# Altium schematic sheet Schematic_Alarm_tone.SchDoc
size Letter
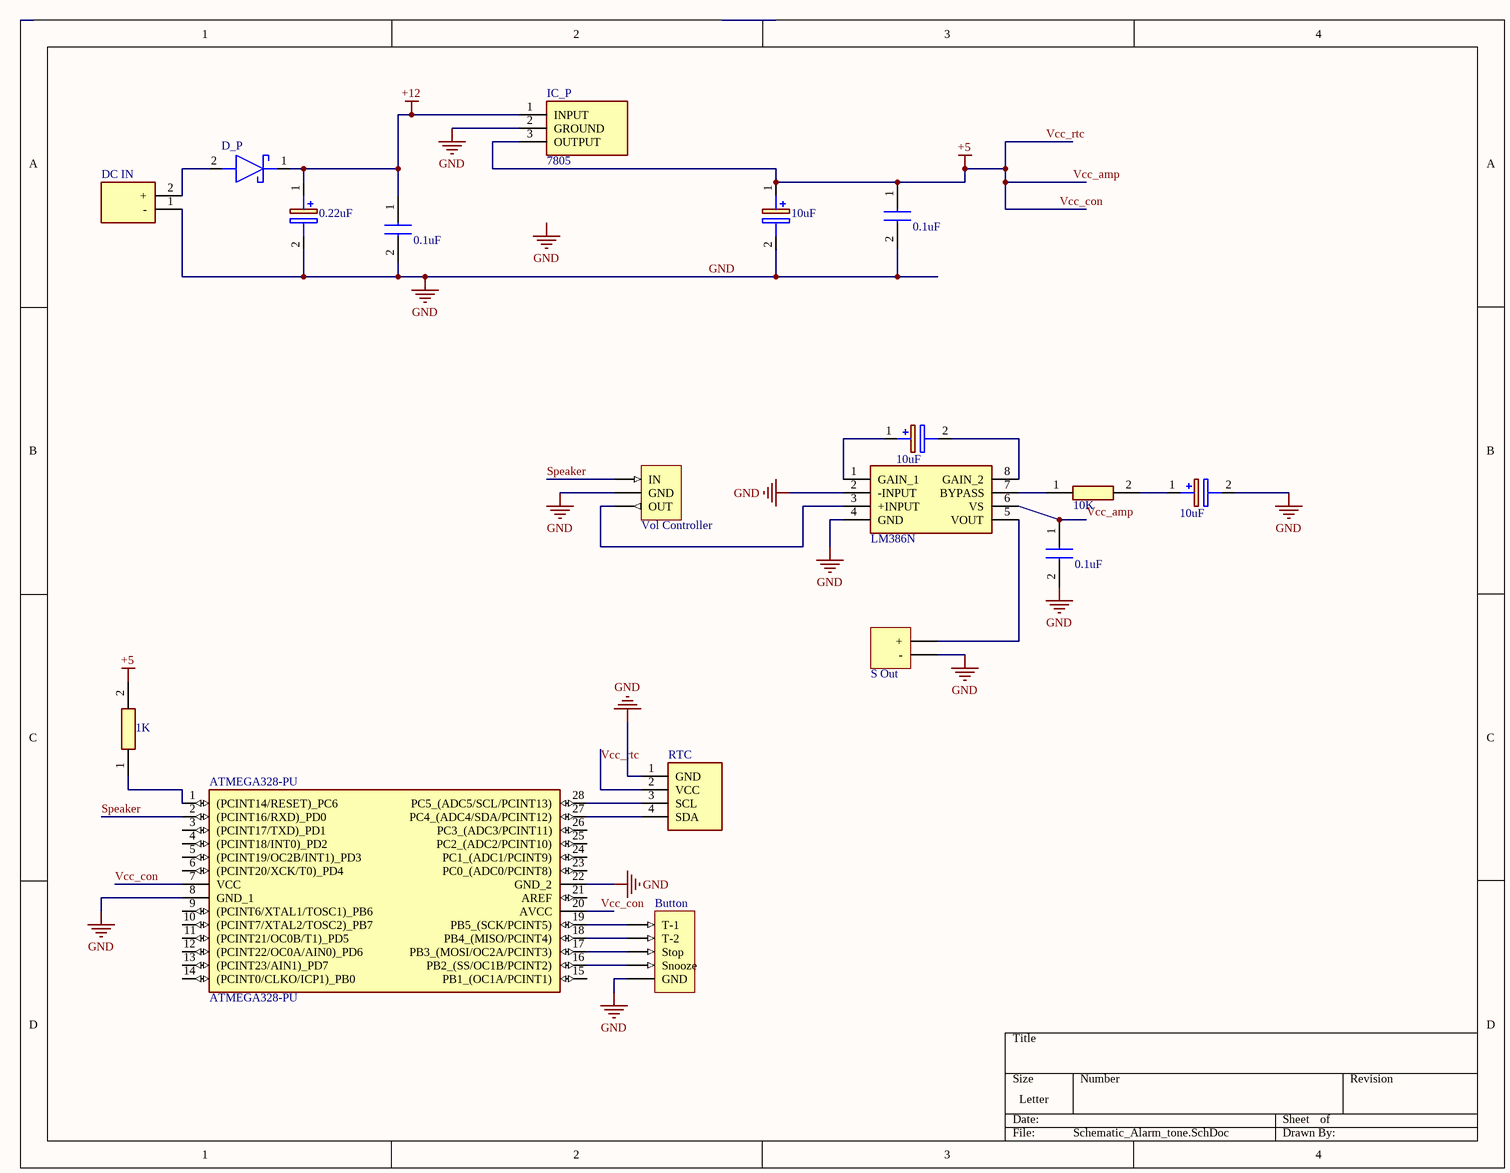
[diagram p0: Schematic_Alarm_tone.SchDoc]

## Parts
ATMEGA328-PU  ATMEGA328-PU  [DIP1016W53P254L3468H457Q28N]
Button  Header 5  [HDR1X5]  (value not drawn)
C1_A  0.1uF  [RCE5C1H103J1A2H03B]
C1_P  0.22uF  [CAPPRD200W52D500H1250]
C2_A  10uF  [CAPPRD200W55D500H1250]
C2_P  0.1uF  [RCE5C1H103J1A2H03B]
C3_A  10uF  [CAPPRD200W55D500H1250]
C3_P  10uF  [CAPPRD200W55D500H1250]
C4_P  0.1uF  [RCE5C1H103J1A2H03B]
D_P  SD103A-TR  [DIOAD950W60L350D150]  (value not drawn)
DC_IN  0010845020  [0010845020]  (value not drawn)
H4  Vol Controller  [HDR1X3]
H5  S Out  [HDR1X2]
IC  LM386N  [DIP787W53P254L982H508Q8N]
IC_P  7805  [TO254P482X997X2018-3P]
R1_amp  10K  [RESAD1650W60L650D250]
R1_reset  1K  [RESAD1680W59L680D250]
RTC  0022032041  [HDRV4W87P0X254_1X4_991X236X1155P]  (value not drawn)

## Nets
+12: C1_P.1(+) C2_P.1 D_P.1(K) IC_P.1(INPUT)
GND: ATMEGA328-PU.8(GND_1) ATMEGA328-PU.22(GND_2) Button.5(GND) C1_A.2 C1_P.2(-) C2_P.2 C3_A.2(-) C3_P.2(-) C4_P.2 DC_IN.1(-) H4.2(GND) H5.1(-) IC.2(-INPUT) IC.4(GND) IC_P.2(GROUND) RTC.1(GND)
Vcc_amp: ATMEGA328-PU.7(VCC) ATMEGA328-PU.20(AVCC) C1_A.1 C3_P.1(+) C4_P.1 IC.6(VS) IC_P.3(OUTPUT) R1_reset.2 RTC.2(VCC)  [also labelled +5, Vcc_con, Vcc_rtc]
Speaker: ATMEGA328-PU.2((PCINT16/RXD)_PD0) H4.1(IN)
NetATMEGA328-PU_1: ATMEGA328-PU.1((PCINT14/RESET)_PC6) R1_reset.1
NetATMEGA328-PU_16: ATMEGA328-PU.16(PB2_(SS/OC1B/PCINT2)) Button.4(Snooze)
NetATMEGA328-PU_17: ATMEGA328-PU.17(PB3_(MOSI/OC2A/PCINT3)) Button.3(Stop)
NetATMEGA328-PU_18: ATMEGA328-PU.18(PB4_(MISO/PCINT4)) Button.2(T-2)
NetATMEGA328-PU_19: ATMEGA328-PU.19(PB5_(SCK/PCINT5)) Button.1(T-1)
NetATMEGA328-PU_27: ATMEGA328-PU.27(PC4_(ADC4/SDA/PCINT12)) RTC.4(SDA)
NetATMEGA328-PU_28: ATMEGA328-PU.28(PC5_(ADC5/SCL/PCINT13)) RTC.3(SCL)
NetC2_A_1: C2_A.1(+) IC.1(GAIN_1)
NetC2_A_2: C2_A.2(-) IC.8(GAIN_2)
NetC3_A_1: C3_A.1(+) R1_amp.2
NetD_P_2: D_P.2(A) DC_IN.2(+)
NetH4_3: H4.3(OUT) IC.3(+INPUT)
NetH5_2: H5.2(+) IC.5(VOUT)
NetIC_7: IC.7(BYPASS) R1_amp.1

Not connected (* = marked no-connect by the designer): ATMEGA328-PU 3((PCINT17/TXD)_PD1) 4((PCINT18/INT0)_PD2) 5((PCINT19/OC2B/INT1)_PD3) 6((PCINT20/XCK/T0)_PD4) 9((PCINT6/XTAL1/TOSC1)_PB6) 10((PCINT7/XTAL2/TOSC2)_PB7) 11((PCINT21/OC0B/T1)_PD5) 12((PCINT22/OC0A/AIN0)_PD6) 13((PCINT23/AIN1)_PD7) 14((PCINT0/CLKO/ICP1)_PB0) 15(PB1_(OC1A/PCINT1)) 21(AREF) 23(PC0_(ADC0/PCINT8)) 24(PC1_(ADC1/PCINT9)) 25(PC2_(ADC2/PCINT10)) 26(PC3_(ADC3/PCINT11))

## Notes on the sheet
- Labels drawn without touching a wire or pin: GND

## Library data of the parts
ATMEGA328-PU = ATMEGA328-PU: Integrated Circuit; Manufacturer_Name: Microchip; Datasheet Link: https://componentsearchengine.com/Datasheets/1/ATMEGA328-PU.pdf; Height: 4.572mm; Manufacturer_Part_Number: ATMEGA328-PU; Mouser Part Number: 556-ATMEGA328-PU; Mouser Price/Stock: https://www.mouser.co.uk/ProductDetail/Microchip-Technology-Atmel/ATMEGA328-PU?qs=lwdSMh1%2FoYJT8tfItQpQtA%3D%3D; Arrow Part Number: ATMEGA328-PU; Arrow Price/Stock: https://www.arrow.com/en/products/atmega328-pu/microchip-technology?region=europe
Button = Header 5: Header, 5-Pin; LatestRevisionDate: 17-Jul-2002; LatestRevisionNote: Re-released for DXP Platform.; Publisher: Altium Limited
C1_A C2_P C4_P = RDER71E104K0K1H03B: Capacitor; Manufacturer_Name: Murata Electronics; Datasheet Link: https://psearch.en.murata.com/capacitor/product/RDER71E104K0K1H03B.html; Height: 5mm; Manufacturer_Part_Number: RDER71E104K0K1H03B
C1_P = 860010772002: Capacitor Polarised; Manufacturer_Name: Wurth Elektronik; Datasheet Link: https://componentsearchengine.com/Datasheets/1/860010772002.pdf; Height: 12.5mm; Manufacturer_Part_Number: 860010772002
C2_A C3_A C3_P = EEU-FR1H100: Capacitor Polarised; Manufacturer_Name: Panasonic; Datasheet Link: https://componentsearchengine.com//EEU-FR1H100.pdf; Height: 12.5mm; Mouser2 Part Number: 667-EEU-FR1H100; Mouser2 Price/Stock: https://www.mouser.com/Search/Refine.aspx?Keyword=667-EEU-FR1H100; Manufacturer_Part_Number: EEU-FR1H100
D_P = SD103A-TR: Schottky Diode; Manufacturer_Name: Vishay; Datasheet Link: https://componentsearchengine.com//SD103A-TR.pdf; Mouser2 Part Number: 625-SD103A; Mouser2 Price/Stock: https://www.mouser.com/Search/Refine.aspx?Keyword=625-SD103A; Manufacturer_Part_Number: SD103A-TR
DC_IN = 0010845020: Connector; Manufacturer_Name: Molex; Datasheet Link: https://www.mouser.com/datasheet/2/276/0010845020_PCB_HEADERS-247555.pdf; Height: 14.22mm; Manufacturer_Part_Number: 0010845020; Mouser Part Number: N/A; Mouser Price/Stock: https://www.mouser.com/Search/Refine.aspx?Keyword=N%2FA; Arrow Part Number: 0010845020; Arrow Price/Stock: https://www.arrow.com/en/products/0010845020/molex
H4 = Header 3: Header, 3-Pin; LatestRevisionDate: 17-Jul-2002; LatestRevisionNote: Re-released for DXP Platform.; Publisher: Altium Limited
H5 = Header 2: Header, 2-Pin; LatestRevisionDate: 17-Jul-2002; LatestRevisionNote: Re-released for DXP Platform.; Publisher: Altium Limited
IC = LM386N-4: Integrated Circuit; Manufacturer_Name: Texas Instruments; Datasheet Link: https://datasheet.datasheetarchive.com/originals/dk/DKDS-22/438053.pdf; Height: 5.08mm; Manufacturer_Part_Number: LM386N-4; Mouser Part Number: 926-LM386N-4; Mouser Price/Stock: https://www.mouser.com/Search/Refine.aspx?Keyword=926-LM386N-4; Arrow Part Number: LM386N-4; Arrow Price/Stock: https://www.arrow.com/en/products/lm386n-4/texas-instruments
IC_P = MC7805CTG: Integrated Circuit; Manufacturer_Name: ON Semiconductor; Datasheet Link: http://www.onsemi.com/pub/Collateral/MC7800-D.PDF; Height: 4.82mm; Manufacturer_Part_Number: MC7805CTG; Mouser Part Number: 863-MC7805CTG; Mouser Price/Stock: https://www.mouser.co.uk/ProductDetail/ON-Semiconductor/MC7805CTG?qs=%252B9%2Fcbd0IE0SRQQJXyw%252B9hQ%3D%3D; Arrow Part Number: MC7805CTG; Arrow Price/Stock: https://www.arrow.com/en/products/mc7805ctg/on-semiconductor?region=asia
R1_amp = MRS25000C1002FRP00: Resistor; Manufacturer_Name: Vishay; Datasheet Link: http://www.vishay.com/docs/28724/mrs16m25.pdf; Manufacturer_Part_Number: MRS25000C1002FRP00; Mouser Part Number: 594-MRS2510K00F; Mouser Price/Stock: https://www.mouser.co.uk/ProductDetail/Vishay-BC-Components/MRS25000C1002FRP00?qs=BLrwpM7T1TlvU75Y03Sdyg%3D%3D; Arrow Part Number: MRS25000C1002FRP00; Arrow Price/Stock: https://www.arrow.com/en/products/mrs25000c1002frp00/vishay?region=nac
R1_reset = MF25_1K2: Resistor; Manufacturer_Name: MULTICOMP; Manufacturer_Part_Number: MF25 1K2; Datasheet Link: https://componentsearchengine.com/Datasheets/2/MF25 1K2.pdf
RTC = 0022032041: Connector; Manufacturer_Name: Molex; Datasheet Link: http://www.molex.com/pdm_docs/sd/022032041_sd.pdf; Height: 11.55mm; Manufacturer_Part_Number: 0022032041; Mouser Part Number: N/A; Mouser Price/Stock: https://www.mouser.co.uk/ProductDetail/Molex/0022032041?qs=PBcRNPEHKsrt5pJfEqGMHQ%3D%3D; Arrow Part Number: 0022032041; Arrow Price/Stock: https://www.arrow.com/en/products/0022032041/molex